# Altium schematic sheet Amplifier.SchDoc
size A; SheetNumber: 9; SheetTotal: 9
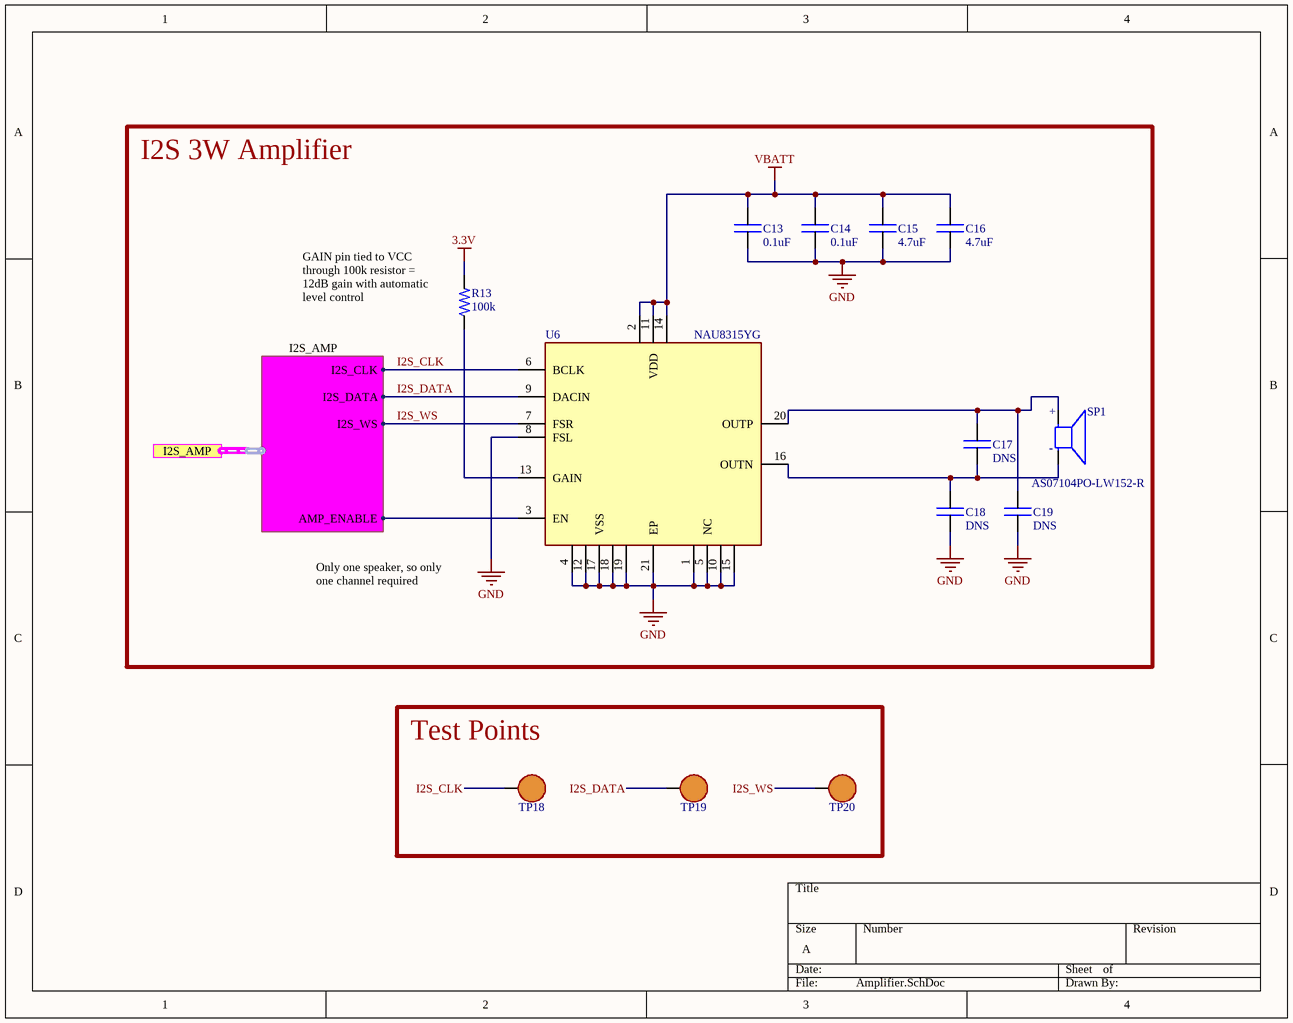
[diagram p0: Amplifier.SchDoc]

## Parts
C13  value 0.1uF  [0402C]  (hidden comment: CAP)
C14  value 0.1uF  [0402C]  (hidden comment: CAP)
C15  value 4.7uF  [0402C]  (hidden comment: CAP)
C16  value 4.7uF  [0402C]  (hidden comment: CAP)
C17  value DNS  [0402C]  (hidden comment: CAP)
C18  value DNS  [0402C]  (hidden comment: CAP)
C19  value DNS  [0402C]  (hidden comment: CAP)
R13  value 100k  [0402R]  (hidden comment: RES)
SP1  AS07104PO-LW152-R  [XMAS_26AWG_AS04004PO-2-LW152-R_SideMount]
TP18  RCWCTE  [RCWCTE]  (value not drawn)
TP19  RCWCTE  [RCWCTE]  (value not drawn)
TP20  RCWCTE  [RCWCTE]  (value not drawn)
U6  NAU8315YG  [20-WFQFN-EP]

## Blocks framed on the sheet
I2S 3W Amplifier: C13-C19 R13 SP1 U6
Test Points: TP18-TP20

## Ports
I2S_AMP (harness I2S_AMP, see Christmas-2024_TSO-PCB_MASTER[2C], MCU[1B])

## Harnesses
I2S_AMP: I2S_CLK, I2S_DATA, I2S_WS, AMP_ENABLE

## Nets
3.3V: R13.2
GND: C13.1 C14.1 C15.1 C16.1 C18.1 C19.1 U6.1(NC) U6.4(VSS) U6.5(NC) U6.8(FSL) U6.10(NC) U6.12(VSS) U6.15(NC) U6.17(VSS) U6.18(VSS) U6.19(VSS) U6.21(EP)
VBATT: C13.2 C14.2 C15.2 C16.2 U6.2(VDD) U6.11(VDD) U6.14(VDD)
I2S_CLK: TP18.1 U6.6(BCLK) ; port I2S_AMP.I2S_CLK
I2S_DATA: TP19.1 U6.9(DACIN) ; port I2S_AMP.I2S_DATA
I2S_WS: TP20.1 U6.7(FSR) ; port I2S_AMP.I2S_WS
NetC17_1: C17.1 C18.2 SP1.N U6.16(OUTN)
NetC17_2: C17.2 C19.2 SP1.P U6.20(OUTP)
NetR13_1: R13.1 U6.13(GAIN)
NetU6_3: U6.3(EN) ; port I2S_AMP.AMP_ENABLE

## Notes on the sheet
- (near R13) GAIN pin tied to VCC through 100k resistor = 12dB gain with automatic level control
- Only one speaker, so only one channel required
- (in symbol SPEAKER 4OHM 3W) +; -

## Library data of the parts
C13 C14 = CAP: Capacitor; MFR: Samsung; MFR PN: CL05B104KP5NNNC; Type: SMD
C15 C16 = CAP: Capacitor; MFR: Samsung; MFR PN: CL05A475MP5NRNC; Type: SMD
C17-C19 = CAP: Capacitor; Type: SMD; MFR: *; MFR PN: *
R13 = RES: Resistor; MFR PN: RC0402FR-07100KL; MFR: YAGEO; Type: SMD
SP1 = SPEAKER 4OHM 3W: SPEAKER 4OHM 3W TOP PORT 86DB; MFR: PUI Audio, Inc.; MFR PN: AS04004PO-2-LW152-R; Type: TH; Power Rating: 3W
TP18-TP20 = TEST POINT: Test Point, Surface Mount; MFR: KOA Speer Electronics, Inc.; MFR PN: RCWCTE; Type: SMD
U6 = I2S 3W AMP: I2S MONO 3.2W CLASS-D AMPLIFIER; MFR: Nuvoton; MFR PN: NAU8315YG; Value: *; Type: SMD; Power Rating: 3.2W